# EasyEDA schematic Custom Made ESP32 by Siam V2.json
TITLE: ESP32 by Siam; REV: 1.0; Date: 2023-10-23; Sheet: 1/1; Drawn By: shakur_siam; Company: Shakur Siam
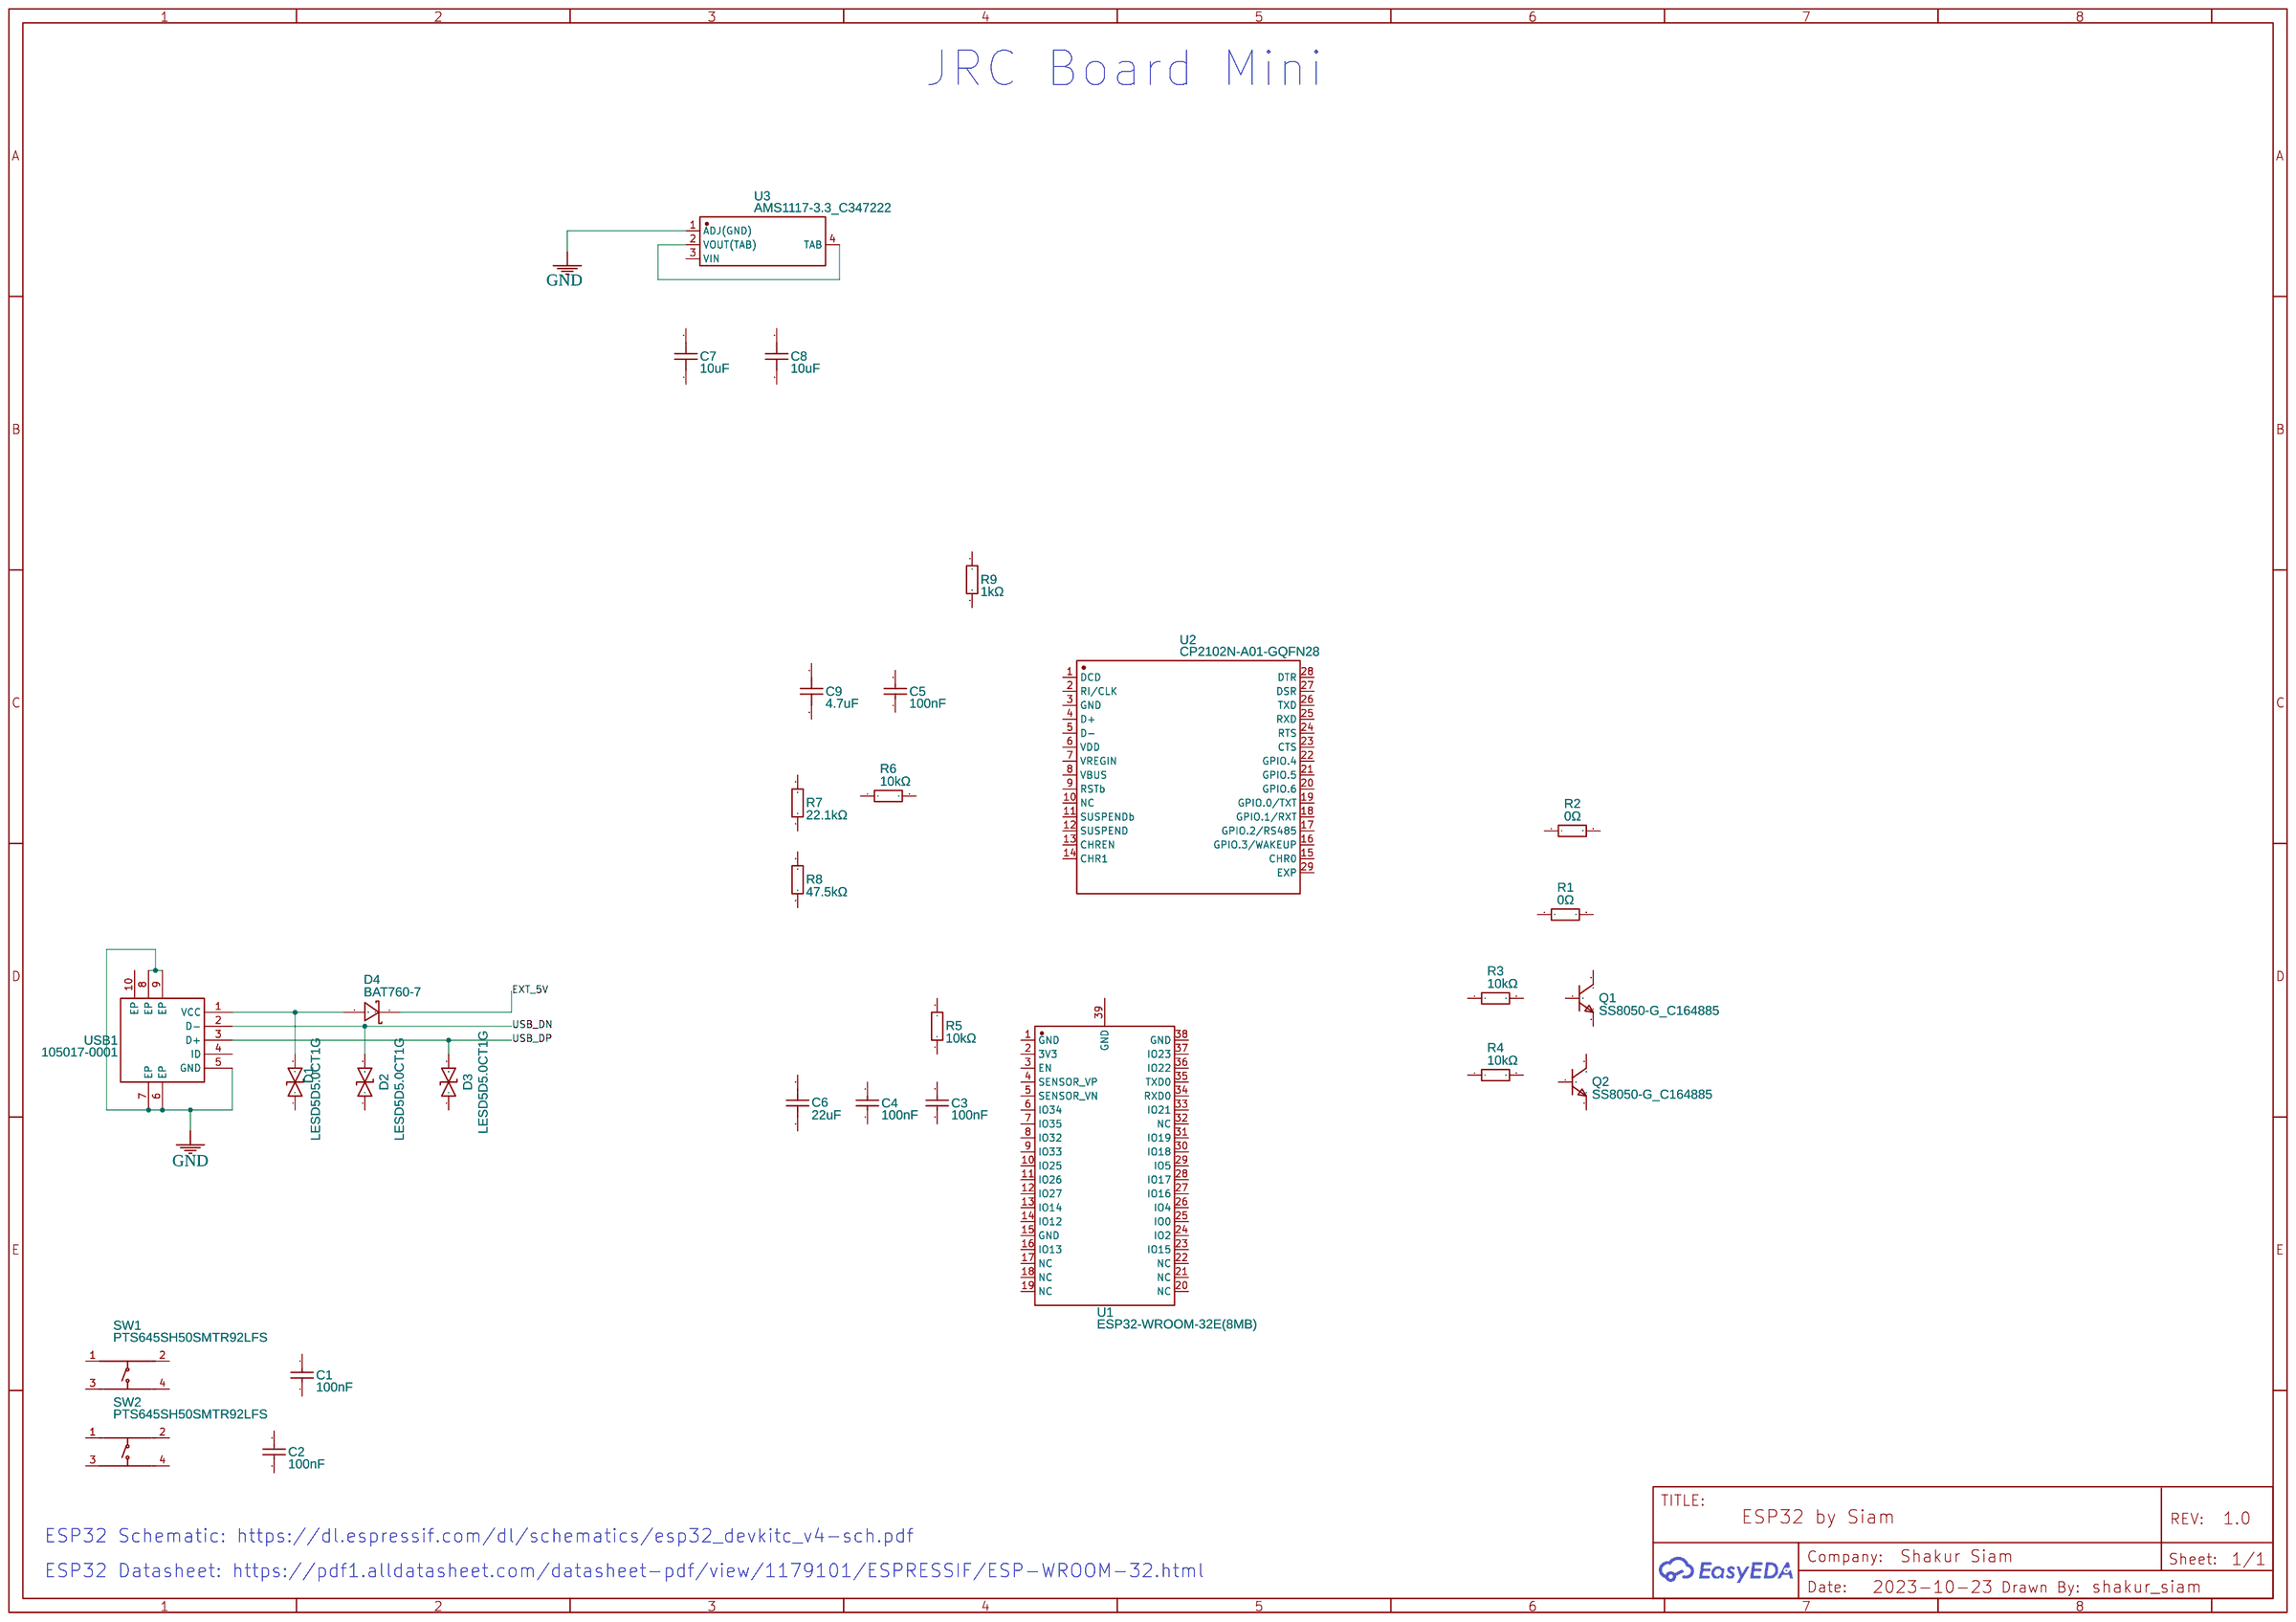
[diagram p0: schematic sheet]

## Parts
C1  100nF  [C0402]
C2  100nF  [C0402]
C3  100nF  [C0402]
C4  100nF  [C0402]
C5  100nF  [C0402]
C6  22uF  [C0805]
C7  10uF  [C0402]
C8  10uF  [C0402]
C9  4.7uF  [C0402]
D1  LESD5D5.0CT1G  [SOD-523_L1.2-W0.8-LS1.6-BI]
D2  LESD5D5.0CT1G  [SOD-523_L1.2-W0.8-LS1.6-BI]
D3  LESD5D5.0CT1G  [SOD-523_L1.2-W0.8-LS1.6-BI]
D4  BAT760-7  [SOD-323_L1.8-W1.3-LS2.5-RD]
Q1  SS8050-G_C164885  [SOT-23-3_L2.9-W1.3-P1.90-LS2.4-BR]
Q2  SS8050-G_C164885  [SOT-23-3_L2.9-W1.3-P1.90-LS2.4-BR]
R1  0Ω  [R0402]
R2  0Ω  [R0402]
R3  10kΩ  [R0402]
R4  10kΩ  [R0402]
R5  10kΩ  [R0402]
R6  10kΩ  [R0402]
R7  22.1kΩ  [R0402]
R8  47.5kΩ  [R0402]
R9  1kΩ  [R0402]
SW1  PTS645SH50SMTR92LFS  [KEY-SMD_4P-L6.0-W6.0-P4.50-LS9.0]
SW2  PTS645SH50SMTR92LFS  [KEY-SMD_4P-L6.0-W6.0-P4.50-LS9.0]
U1  ESP32-WROOM-32E(8MB)  [WIFI-SMD_ESP32-WROOM-32E]
U2  CP2102N-A01-GQFN28  [QFN-28_L5.0-W5.0-P0.50-BL-EP3.3]
U3  AMS1117-3.3_C347222  [SOT-223-4_L6.5-W3.5-P2.30-LS7.0-BR]
USB1  105017-0001  [MICRO-USB-SMD_105017-0001]

## Library data of the parts
C1-C5 = CL05B104KO5NNNC: Supplier: LCSC; Manufacturer: SAMSUNG(三星); Supplier Part: C1525; JLCPCB Part Class: Basic Part; link: https://lcsc.com/eda_search?q=C1525&%26type=1&ref=editor
C6 = CL21A226MAYNNNE: Contributor: LCSC; Supplier: LCSC; Supplier Part: C602037; Manufacturer: SAMSUNG(三星); JLCPCB Part Class: Extended Part; link: https://lcsc.com/eda_search?q=C602037&%26type=1&ref=editor
C7 C8 = CL05A106MP5NUNC_C315248: Contributor: LCSC; Supplier: LCSC; Supplier Part: C315248; Manufacturer: SAMSUNG(三星); Manufacturer Part: CL05A106MP5NUNC; JLCPCB Part Class: Extended Part; link: https://lcsc.com/eda_search?q=C315248&%26type=1&ref=editor
C9 = CL05A475KP5NRNC: Contributor: LCSC; Supplier: LCSC; Supplier Part: C368809; Manufacturer: SAMSUNG(三星); JLCPCB Part Class: Extended Part; link: https://lcsc.com/eda_search?q=C368809&%26type=1&ref=editor
D1-D3 = LESD5D5.0CT1G: Contributor: LCSC; Supplier: LCSC; Supplier Part: C383211; Manufacturer: LRC(乐山无线电); JLCPCB Part Class: Extended Part; link: https://lcsc.com/eda_search?q=C383211&%26type=1&ref=editor
D4 = BAT760-7: Contributor: LCSC; Supplier: LCSC; Manufacturer: DIODES(美台); Supplier Part: C124187; JLCPCB Part Class: Extended Part; link: https://lcsc.com/eda_search?q=C124187&%26type=1&ref=editor
Q1 Q2 = SS8050-G_C164885: Contributor: LCSC; Supplier: LCSC; Supplier Part: C164885; Manufacturer: CJ(江苏长电/长晶); Manufacturer Part: SS8050-G; JLCPCB Part Class: Extended Part; link: https://lcsc.com/eda_search?q=C164885&%26type=1&ref=editor
R1 R2 = 0402WGF0000TCE: Supplier: LCSC; Manufacturer: UNI-ROYAL(厚声); Supplier Part: C17168; JLCPCB Part Class: Basic Part; link: https://lcsc.com/eda_search?q=C17168&%26type=1&ref=editor
R3-R6 = 0402WGF1002TCE: Supplier: LCSC; Manufacturer: UNI-ROYAL(厚声); Supplier Part: C25744; JLCPCB Part Class: Basic Part; link: https://lcsc.com/eda_search?q=C25744&%26type=1&ref=editor
R7 = 0402WGF2212TCE: Supplier: LCSC; Manufacturer: UNI-ROYAL(厚声); Supplier Part: C43473; JLCPCB Part Class: Extended Part; link: https://lcsc.com/eda_search?q=C43473&%26type=1&ref=editor
R8 = 0402WGF4752TCE: Supplier: LCSC; Manufacturer: UNI-ROYAL(厚声); Supplier Part: C25896; JLCPCB Part Class: Extended Part; link: https://lcsc.com/eda_search?q=C25896&%26type=1&ref=editor
R9 = 0402WGF1001TCE: Supplier: LCSC; Manufacturer: UNI-ROYAL(厚声); Supplier Part: C11702; JLCPCB Part Class: Basic Part; link: https://lcsc.com/eda_search?q=C11702&%26type=1&ref=editor
SW1 SW2 = PTS645SH50SMTR92LFS: Contributor: LCSC; Supplier: LCSC; Supplier Part: C221869; Manufacturer: C&K; JLCPCB Part Class: Extended Part; link: https://lcsc.com/eda_search?q=C221869&%26type=1&ref=editor
U1 = ESP32-WROOM-32E(8MB): Contributor: LCSC; Supplier: LCSC; Supplier Part: C701342; Manufacturer: ESPRESSIF(乐鑫); Manufacturer Part: ESP32-WROOM-32E-N8; JLCPCB Part Class: Extended Part; link: https://lcsc.com/eda_search?q=C701342&%26type=1&ref=editor
U2 = CP2102N-A01-GQFN28: Contributor: LCSC; Supplier: LCSC; Manufacturer: SILICON LABS(芯科); Manufacturer Part: CP2102N-A01-GQFN28R; Supplier Part: C105167; JLCPCB Part Class: Extended Part; link: https://lcsc.com/eda_search?q=C105167&%26type=1&ref=editor
U3 = AMS1117-3.3_C347222: Contributor: LCSC; Supplier: LCSC; Supplier Part: C347222; Manufacturer: UMW(广东友台半导体); Manufacturer Part: AMS1117-3.3; JLCPCB Part Class: Extended Part; link: https://lcsc.com/eda_search?q=C347222&%26type=1&ref=editor
USB1 = 105017-0001: Contributor: LCSC; Supplier: LCSC; Manufacturer: MOLEX; Manufacturer Part: 1050170001; Supplier Part: C136000; JLCPCB Part Class: Extended Part; link: https://lcsc.com/eda_search?q=C136000&%26type=1&ref=editor

## Nets
GND: U3.1(ADJ(GND)) USB1.5(GND) USB1.6(EP) USB1.7(EP) USB1.8(EP) USB1.9(EP)
EXT_5V: D4.1
USB_DN: D2.2 USB1.2(D-)
USB_DP: D3.2 USB1.3(D+)
Net-(D1-2): D1.2 D4.2 USB1.1(VCC)
Net-(U3-2): U3.2(VOUT(TAB)) U3.4(TAB)

Not connected (* = marked no-connect by the designer): C1 1 2; C2 1 2; C3 1 2; C4 1 2; C5 1 2; C6 1 2; C7 1 2; C8 1 2; C9 1 2; D1 1; D2 1; D3 1; Q1 1(B) 2(E) 3(C); Q2 1(B) 2(E) 3(C); R1 1 2; R2 1 2; R3 1 2; R4 1 2; R5 1 2; R6 1 2; R7 1 2; R8 1 2; R9 1 2; SW1 1 2 3 4; SW2 1 2 3 4; U1 1(GND) 2(3V3) 3(EN) 4(SENSOR_VP) 5(SENSOR_VN) 6(IO34) 7(IO35) 8(IO32) 9(IO33) 10(IO25) 11(IO26) 12(IO27) 13(IO14) 14(IO12) 15(GND) 16(IO13) 17(NC) 18(NC) 19(NC) 20(NC) 21(NC) 22(NC) 23(IO15) 24(IO2) 25(IO0) 26(IO4) 27(IO16) 28(IO17) 29(IO5) 30(IO18) 31(IO19) 32(NC) 33(IO21) 34(RXD0) 35(TXD0) 36(IO22) 37(IO23) 38(GND) 39(GND); U2 1(DCD) 2(RI/CLK) 3(GND) 4(D+) 5(D-) 6(VDD) 7(VREGIN) 8(VBUS) 9(RSTb) 10(NC) 11(SUSPENDb) 12(SUSPEND) 13(CHREN) 14(CHR1) 15(CHR0) 16(GPIO.3/WAKEUP) 17(GPIO.2/RS485) 18(GPIO.1/RXT) 19(GPIO.0/TXT) 20(GPIO.6) 21(GPIO.5) 22(GPIO.4) 23(CTS) 24(RTS) 25(RXD) 26(TXD) 27(DSR) 28(DTR) 29(EXP); U3 3(VIN); USB1 4(ID) 10(EP)

## Notes on the sheet
- JRC Board Mini
- ESP32 Schematic: https://dl.espressif.com/dl/schematics/esp32_devkitc_v4-sch.pdf
- ESP32 Datasheet: https://pdf1.alldatasheet.com/datasheet-pdf/view/1179101/ESPRESSIF/ESP-WROOM-32.html
